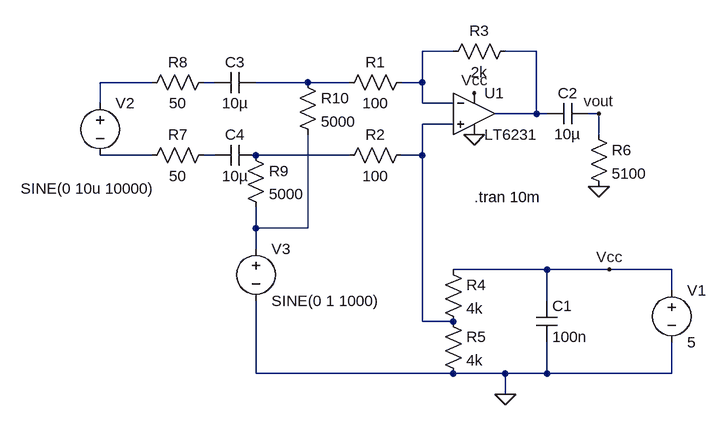
[diagram p0: schematic Draft1.asc]
Draft1.asc, the LTspice schematic file:
Version 4
SHEET 1 880 680
WIRE 96 64 48 64
WIRE 224 64 176 64
WIRE -368 112 -448 112
WIRE -272 112 -288 112
WIRE -128 112 -208 112
WIRE -64 112 -128 112
WIRE 48 112 48 64
WIRE 48 112 16 112
WIRE -448 144 -448 112
WIRE 48 144 48 112
WIRE 96 144 48 144
WIRE 224 160 224 64
WIRE 224 160 160 160
WIRE 240 160 224 160
WIRE 320 160 304 160
WIRE 96 176 48 176
WIRE 320 192 320 160
WIRE -368 224 -448 224
WIRE -272 224 -288 224
WIRE -64 224 -208 224
WIRE 48 224 48 176
WIRE 48 224 16 224
WIRE -208 336 -208 304
WIRE -128 336 -128 192
WIRE -128 336 -208 336
WIRE -208 368 -208 336
WIRE 240 400 96 400
WIRE 336 400 240 400
WIRE 432 400 336 400
WIRE 432 432 432 400
WIRE 240 448 240 400
WIRE 48 480 48 224
WIRE 96 480 48 480
WIRE -208 560 -208 448
WIRE 96 560 -208 560
WIRE 176 560 96 560
WIRE 240 560 240 512
WIRE 240 560 176 560
WIRE 432 560 432 512
WIRE 432 560 240 560
WIRE 176 592 176 560
FLAG 128 192 0
FLAG 128 128 Vcc
FLAG 176 592 0
FLAG 336 400 Vcc
FLAG 320 272 0
FLAG 320 160 vout
SYMBOL res 32 96 R90
WINDOW 0 0 56 VBottom 2
WINDOW 3 32 56 VTop 2
SYMATTR InstName R1
SYMATTR Value 100
SYMBOL res 32 208 R90
WINDOW 0 0 56 VBottom 2
WINDOW 3 32 56 VTop 2
SYMATTR InstName R2
SYMATTR Value 100
SYMBOL res 192 48 R90
WINDOW 0 0 56 VBottom 2
WINDOW 3 32 56 VTop 2
SYMATTR InstName R3
SYMATTR Value 2k
SYMBOL OpAmps\\LT6231 128 160 R0
SYMATTR InstName U1
SYMBOL res 80 384 R0
SYMATTR InstName R4
SYMATTR Value 4k
SYMBOL res 80 464 R0
SYMATTR InstName R5
SYMATTR Value 4k
SYMBOL cap 224 448 R0
SYMATTR InstName C1
SYMATTR Value 100n
SYMBOL voltage 432 416 R0
WINDOW 123 0 0 Left 0
WINDOW 39 24 124 Left 2
SYMATTR InstName V1
SYMATTR Value 5
SYMBOL res 304 176 R0
SYMATTR InstName R6
SYMATTR Value 5100
SYMBOL voltage -448 128 R0
WINDOW 3 -122 147 Left 2
WINDOW 123 0 0 Left 0
WINDOW 39 0 0 Left 0
SYMATTR Value SINE(0 10u 10000)
SYMATTR InstName V2
SYMBOL voltage -208 352 R0
WINDOW 123 0 0 Left 0
WINDOW 39 0 0 Left 0
SYMATTR InstName V3
SYMATTR Value SINE(0 1 1000)
SYMBOL res -272 208 R90
WINDOW 0 0 56 VBottom 2
WINDOW 3 32 56 VTop 2
SYMATTR InstName R7
SYMATTR Value 50
SYMBOL res -272 96 R90
WINDOW 0 0 56 VBottom 2
WINDOW 3 32 56 VTop 2
SYMATTR InstName R8
SYMATTR Value 50
SYMBOL res -224 208 R0
SYMATTR InstName R9
SYMATTR Value 5000
SYMBOL res -144 96 R0
SYMATTR InstName R10
SYMATTR Value 5000
SYMBOL cap 304 144 R90
WINDOW 0 0 32 VBottom 2
WINDOW 3 32 32 VTop 2
SYMATTR InstName C2
SYMATTR Value 10µ
SYMBOL cap -208 96 R90
WINDOW 0 0 32 VBottom 2
WINDOW 3 32 32 VTop 2
SYMATTR InstName C3
SYMATTR Value 10µ
SYMBOL cap -208 208 R90
WINDOW 0 0 32 VBottom 2
WINDOW 3 32 32 VTop 2
SYMATTR InstName C4
SYMATTR Value 10µ
TEXT 128 288 Left 2 !.tran 10m

The netlist it stands for:
* Draft1.asc
R1 N001 N005 100
R2 N006 N009 100
R3 N002 N001 2k
XU1 N006 N001 N002 Vcc 0 LT6231  ; pins In+ In- OUT V+ V-
R4 Vcc N006 4k
R5 N006 0 4k
C1 Vcc 0 100n
V1 Vcc 0 5
R6 vout 0 5100
V2 N003 N007 SINE(0 10u 10000)
V3 N010 0 SINE(0 1 1000)
R7 N008 N007 50
R8 N004 N003 50
R9 N009 N010 5000
R10 N005 N010 5000
C2 vout N002 10µ
C3 N005 N004 10µ
C4 N009 N008 10µ
.tran 10m
.lib LTC2.lib
.backanno
.end